# EAGLE design usbtiny-v2-SS (EAGLE 6.2)
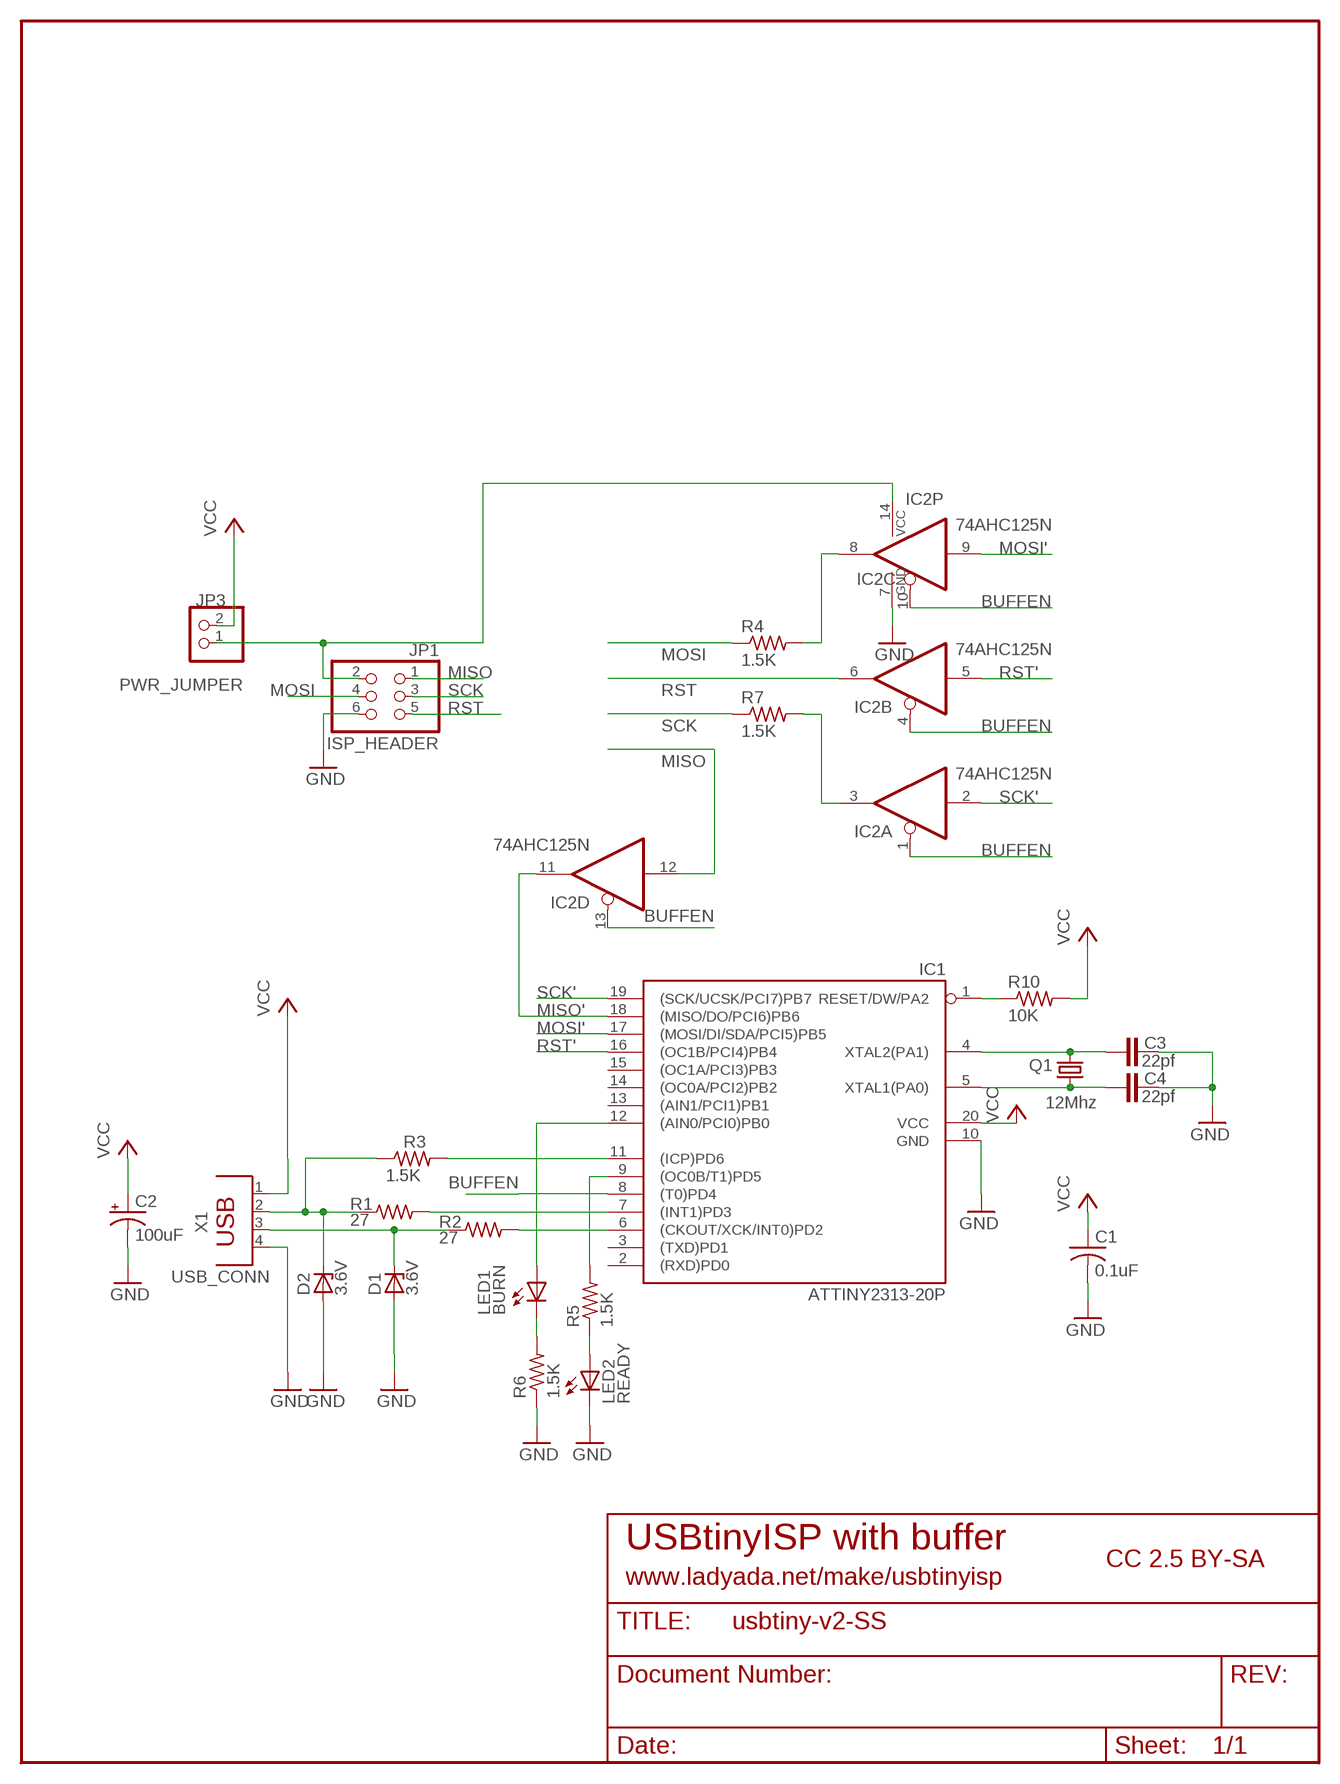
[diagram p0: schematic, sheet 1]

## Parts
C1  0.1uF  C-US025-025X050  [C025-025X050]
C2  100uF  CPOL-USE2.5-5  [E2,5-5]
C3  22pf  C-EU025-025X050  [C025-025X050]
C4  22pf  C-EU025-025X050  [C025-025X050]
D1  3.6V  ZENER-DIODEDO35Z10  [DO35Z10]
D2  3.6V  ZENER-DIODEDO35Z10  [DO35Z10]
IC1  ATTINY2313-20P  [DIL20]
IC2  74AHC125N  74HC125N  [DIL14]
JP1  ISP_HEADER  PINHD-2X3  [2X03]
JP3  PWR_JUMPER  PINHD-1X2  [1X02]
LED1  BURN  LED3MM  [LED3MM]
LED2  READY  LED3MM  [LED3MM]
Q1  12Mhz  CRYSTALHC49S  [HC49/S]
R1  27  R-US_0207/10  [0207/10]
R2  27  R-US_0207/10  [0207/10]
R3  1.5K  R-US_0207/10  [0207/10]
R4  1.5K  R-US_0207/10  [0207/10]
R5  1.5K  R-US_0207/2V  [0207/2V]
R6  1.5K  R-US_0207/2V  [0207/2V]
R7  1.5K  R-US_0207/10  [0207/10]
R10  10K  R-US_0207/10  [0207/10]
X1  USB_CONN  PN61729  [PN61729]

## Nets
BUFFEN: IC1.8((T0)PD4) IC2.1(A:OE) IC2.4(B:OE) IC2.10(C:OE) IC2.13(D:OE)
GND: C1.2 C2.- C3.2 C4.2 D1.A D2.A IC1.10(GND) IC2.7(P:GND) JP1.6 LED2.K(C) R6.1 X1.4
MISO: IC2.12(D:I) JP1.1
MISO': IC1.18((MISO/DO/PCI6)PB6) IC2.11(D:O)
MOSI: JP1.4 R4.1
MOSI': IC1.17((MOSI/DI/SDA/PCI5)PB5) IC2.9(C:I)
N$1: D2.C R1.1 R3.1 X1.2
N$2: D1.C R2.1 X1.3
N$3: IC1.7((INT1)PD3) R1.2
N$6: IC1.6((CKOUT/XCK/INT0)PD2) R2.2
N$7: IC1.12((AIN0/PCI0)PB0) LED1.A
N$8: LED1.K(C) R6.2
N$9: IC1.1(RESET/DW/PA2) R10.1
N$10: IC1.9((OC0B/T1)PD5) R5.2
N$11: LED2.A R5.1
N$12: IC2.3(A:O) R7.2
N$13: IC2.8(C:O) R4.2
N$16: IC1.11((ICP)PD6) R3.2
N$17: C3.1 IC1.4(XTAL2(PA1)) Q1.2
N$18: C4.1 IC1.5(XTAL1(PA0)) Q1.1
RST: IC2.6(B:O) JP1.5
RST': IC1.16((OC1B/PCI4)PB4) IC2.5(B:I)
SCK: JP1.3 R7.1
SCK': IC1.19((SCK/UCSK/PCI7)PB7) IC2.2(A:I)
VCC: C1.1 C2.+ IC1.20(VCC) JP3.2 R10.2 X1.1
VCC_REMOTE: IC2.14(P:VCC) JP1.2 JP3.1
Unconnected: IC1.2((RXD)PD0) IC1.3((TXD)PD1) IC1.13((AIN1/PCI1)PB1) IC1.14((OC0A/PCI2)PB2) IC1.15((OC1A/PCI3)PB3)

## Notes on the sheet
- USBtinyISP with buffer
- CC 2.5 BY-SA
- www.ladyada.net/make/usbtinyisp

## Library data of the parts
C1 = rcl-ez:C-US: CAPACITOR, American symbol
C2 = rcl-ez:CPOL-US: POLARIZED CAPACITOR, American symbol
C3 C4 = rcl:C-EU: CAPACITOR, European symbol
D1 D2 = diode:ZENER-DIODE: Z-Diode
IC1 = avr:ATTINY2313: MICROCONTROLLER 2 Kbytes FLASH 128 bytes SRAM 128 bytes EEPROM USART USI
IC2 = 74xx-eu:74*125: Quad bus BUFFER, 3-state
JP1 = pinhead-ez:PINHD-2X3: PIN HEADER
JP3 = pinhead:PINHD-1X2: PIN HEADER
LED1 LED2 = minimidi:LED: LED OSRAM: - CHIPLED LG R971, LG N971, LY N971, LG Q971, LY Q971, LO R971, LY R971 LH N974, LH R974 LS Q976, LO Q976, LY Q976 LO Q996 - Hyper CHIPLED LW Q18S LB Q993, LB Q99A, LB R99A - SideLED LS A670, LO A670, LY A670, LG A670, LP A670 LB A673, LV A673, LT A673, LW A673 LH A674 LY A675 LS A676, LA A676, LO A676, LY A676, LW A676 LS A679, LY A679, LG A679 - Hyper Micro SIDELED® LS Y876, LA Y876, LO Y876, LY Y876 LT Y87S - SmartLED LW L88C, LW L88S LB L89C, LB L89S, LG L890 LS L89K, LO L89K, LY L89K LS L896, LA L896, LO L896, LY L896 - TOPLED LS T670, LO T670, LY T670, LG T670, LP T670 LSG T670, LSP T670, LSY T670, LOP T670, LYG T670 LG T671, LOG T671, LSG T671 LB T673, LV T673, LT T673, LW T673 LH T674 LS T676, LA T676, LO T676, LY T676, LB T676, LH T676, LSB T676, LW T676 LB T67C, LV T67C, LT T67C, LS T67K, LO T67K, LY T67K, LW E67C LS E67B, LA E67B, LO E67B, LY E67B, LB E67C, LV E67C, LT E67C LW T67C LS T679, LY T679, LG T679 LS T770, LO T770, LY T770, LG T770, LP T770 LB T773, LV T773, LT T773, LW T773 LH T774 LS E675, LA E675, LY E675, LS T675 LS T776, LA T776, LO T776, LY T776, LB T776 LHGB T686 LT T68C, LB T68C - Hyper Mini TOPLED® LB M676 - Mini TOPLED Santana® LG M470 LS M47K, LO M47K, LY M47K Source: http://www.osram.convergy.de/
Q1 = crystal:CRYSTAL: CRYSTAL
R1-R7 R10 = rcl-ez:R-US_: RESISTOR, American symbol
X1 = con-berg-ez:PN61729: BERG USB connector

## Board
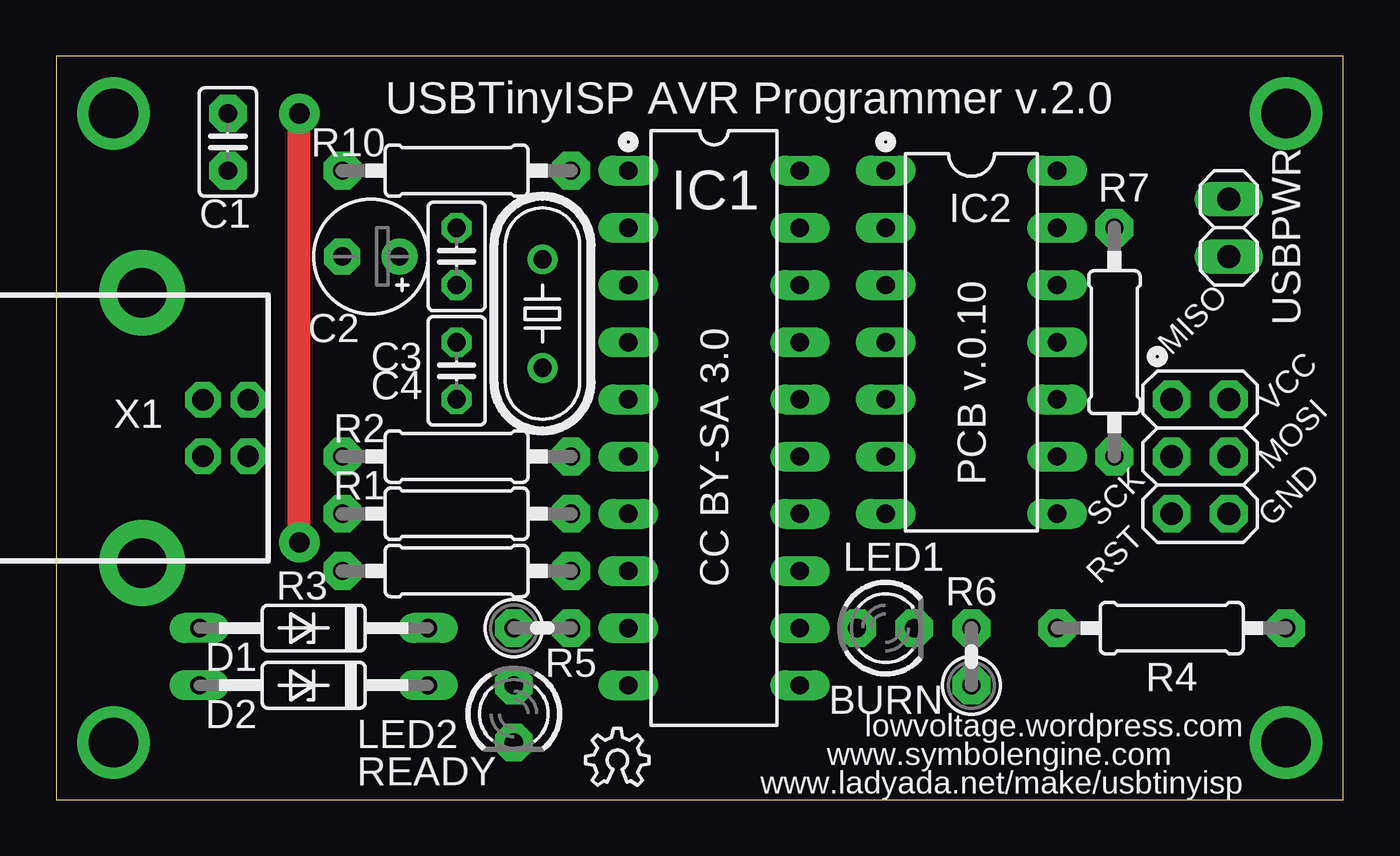
[diagram p1: board, top side]
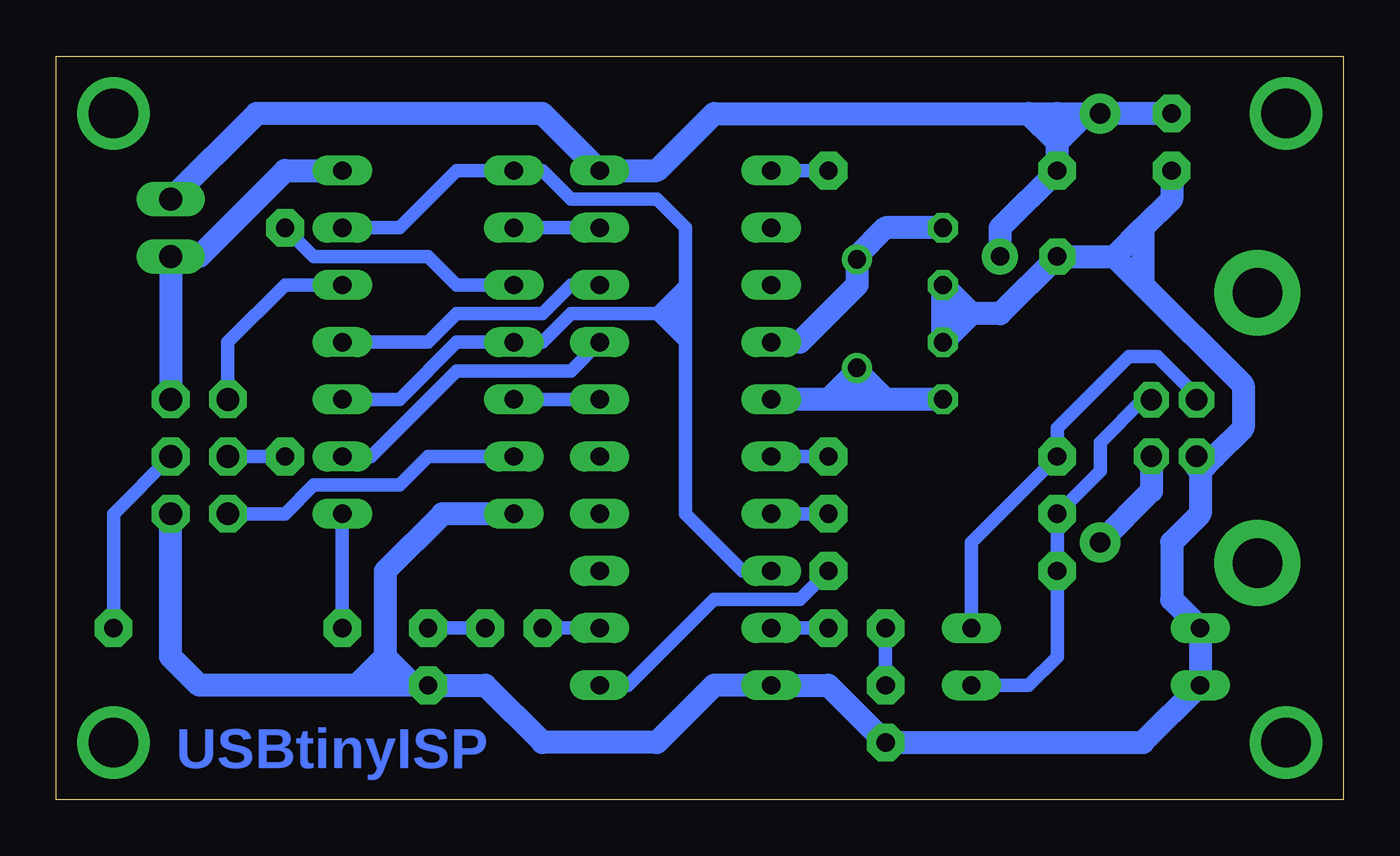
[diagram p2: board, bottom side, seen from below]

Size 57.15 x 33.02 mm. Coordinates in mm from the lower left corner, seen from the top.
Outline: 0,0 57.15,0 57.15,33.02 0,33.02 0,0
Copper layers (1*16): Top 0.035mm / dielectric 1.5mm / Bottom 0.035mm
Design rules: minimum track width 10mil, minimum drill 24mil, track to track 8mil, track to pad 8mil, pad to pad 8mil, via to via 8mil, smd to smd 8mil, copper to edge 40mil, drill to drill 8mil, minimum pad ring 10mil, minimum via ring 8mil, stop-mask expansion 4mil, vias tented up to drill 0mil, thermal gap 10mil

### Footprints (pad centres in the part's own frame; a part is rotated, then mirrored left to right if it is on the bottom)
C025-025X050 = drill 0.813 pad 1.676 octagon: 1 -1.27,0; 2 1.27,0
E2,5-5 = drill 0.813 pad 1.6: + -1.27,0 | drill 0.813 pad 1.6 octagon: - 1.27,0
C025-025X050' = drill 0.813 octagon: 1 -1.27,0; 2 1.27,0
DO35Z10 = drill 0.813 long: A 5.08,0; C -5.08,0
DIL20 = drill 0.813 long: 1 -11.43,-3.81; 2 -8.89,-3.81; 3 -6.35,-3.81; 4 -3.81,-3.81; 5 -1.27,-3.81; 6 1.27,-3.81; 7 3.81,-3.81; 8 6.35,-3.81; 9 8.89,-3.81; 10 11.43,-3.81; 11 11.43,3.81; 12 8.89,3.81; 13 6.35,3.81; 14 3.81,3.81; 15 1.27,3.81; 16 -1.27,3.81; 17 -3.81,3.81; 18 -6.35,3.81; 19 -8.89,3.81; 20 -11.43,3.81
DIL14 = drill 0.813 long: 1 -7.62,-3.81; 2 -5.08,-3.81; 3 -2.54,-3.81; 4 0,-3.81; 5 2.54,-3.81; 6 5.08,-3.81; 7 7.62,-3.81; 8 7.62,3.81; 9 5.08,3.81; 10 2.54,3.81; 11 0,3.81; 12 -2.54,3.81; 13 -5.08,3.81; 14 -7.62,3.81
2X03 = drill 1.016 pad 1.676 octagon: 1 -2.54,-1.27; 2 -2.54,1.27; 3 0,-1.27; 4 0,1.27; 5 2.54,-1.27; 6 2.54,1.27
1X02 = drill 1.016 long: 1 -1.27,0; 2 1.27,0
LED3MM = drill 0.813 pad 1.676 octagon: A -1.27,0; K 1.27,0
HC49/S = drill 0.813: 1 -2.413,0; 2 2.413,0
0207/10 = drill 0.813 pad 1.676 octagon: 1 -5.08,0; 2 5.08,0
0207/2V = drill 0.813 pad 1.676 octagon: 1 -1.27,0; 2 1.27,0
PN61729 = drill 0.95 pad 1.575 octagon: 1 1.25,4.71; 2 -1.25,4.71; 3 -1.25,2.71; 4 1.25,2.71 | drill 2.2 pad 3.81: P$1 -6,0; P$2 6,0

### Placement (x,y rotation side)
C1  7.62,29.21 270 top
C2  13.97,24.13 180 top
C3  22pf  [C025-025X050']  17.78,24.13 270 top
C4  22pf  [C025-025X050']  17.78,19.05 90 top
D1  11.43,7.62 180 top
D2  11.43,5.08 180 top
IC1  29.21,16.51 270 top
IC2  40.64,20.32 270 top
JP1  50.8,15.24 270 top
JP3  52.07,25.4 90 top
LED1  36.83,7.62 0 top
LED2  20.32,3.81 270 top
Q1  21.59,21.59 90 top
R1  17.78,12.7 0 top
R2  17.78,15.24 0 top
R3  17.78,10.16 0 top
R4  49.53,7.62 180 top
R5  21.59,7.62 0 top
R6  40.64,6.35 90 top
R7  46.99,20.32 90 top
R10  17.78,27.94 180 top
U$1  [OSHW_6X100_NOTEXT]  23.5,0.64 0 top
X1  3.81,16.51 270 top

### Tracks (layer width: path | path; a pad name or v marks a point on that pad's centre or on a via)
BUFFEN
  Bottom 0.61: 29.21,20.32 30.48,21.59 | 29.21,20.32 29.21,12.7 26.67,10.16 IC1.8 | IC2.13 41.91,25.4 39.37,27.94 IC2.1 35.56,27.94 34.29,26.67 30.48,26.67 29.21,25.4 29.21,22.86 | 29.21,22.86 29.21,22.23 | 29.21,22.23 29.21,21.59 | 29.21,21.59 29.21,20.95 | 29.21,20.95 29.21,20.32 | 30.48,21.59 29.21,22.86 | 30.48,21.59 29.84,21.59 | 29.84,21.59 29.21,21.59 | 29.21,22.23 29.84,21.59 | 29.21,20.95 29.84,21.59 | 30.48,21.59 34.29,21.59 35.56,20.32 IC2.4 39.37,20.32 41.91,17.78 IC2.10
GND
  Bottom 1.016: IC2.7 40.01,12.7 42.55,10.16 42.55,6.35 | JP1.6 52.07,6.35 50.8,5.08 44.45,5.08 43.81,5.08 | 42.55,5.08 43.18,5.08 43.81,5.08 | 16.51,21.59 15.24,21.59 C2.- 10.16,24.13 | 17.78,21.59 16.51,21.59 | 16.51,21.59 C4.2 C3.2 16.51,21.59 | 42.55,6.35 42.55,5.08 | 6.35,14.61 6.52,14.78 X1.4 6.5,15.24 5.71,15.24 | 6.35,14.61 6.35,12.7 7.62,11.43 7.62,8.89 D1.A D2.A 8.89,2.54 LED2.K 22.86,5.08 IC1.10 27.94,5.08 30.48,2.54 35.56,2.54 38.1,5.08 R6.1 41.27,5.08 | 10.16,24.13 8.89,22.86 | 8.89,22.86 4.45,18.41 4.45,16.51 5.71,15.24 | 5.71,15.24 6.35,14.61 | 41.27,5.08 42.55,5.08 | C1.2 7.62,26.67 8.89,25.4 | 8.89,25.4 10.16,24.13 | 8.89,25.4 8.89,22.86 | 43.81,5.08 42.55,6.35 | 42.55,6.35 41.27,5.08
MISO
  Bottom 0.61: IC2.12 46.99,22.86 49.53,20.32 JP1.1
MISO'
  Bottom 0.61: IC1.18 34.29,22.86 35.56,21.59 39.37,21.59 40.64,20.32 IC2.11
MOSI
  Bottom 0.61: JP1.4 54.61,12.7 R4.1
MOSI'
  Bottom 0.61: IC1.17 34.29,19.05 39.37,19.05 43.18,15.24 IC2.9
N$1
  Bottom 0.61: D2.C 13.97,5.08 12.7,6.35 R3.1 R1.1 10.79,14.61 10.79,15.88 8.89,17.78 8.54,17.78 X1.2
N$2
  Bottom 0.61: D1.C 16.51,11.43 R2.1 12.7,16.51 9.53,19.68 8.26,19.68 6.52,17.95 X1.3
N$3
  Bottom 0.61: R1.2 IC1.7
N$4  (via drill 2.2 pad 2.54)
  other vias: 2.54,30.48
N$6
  Bottom 0.61: IC1.6 R2.2
N$7
  Bottom 0.61: LED1.A IC1.12
N$8
  Bottom 0.61: LED1.K R6.2
N$9
  Bottom 0.61: R10.1 IC1.1
N$10
  Bottom 0.61: R5.2 IC1.9
N$11
  Bottom 0.61: LED2.A R5.1
N$12
  Bottom 0.61: IC2.3 39.37,22.86 40.64,24.13 45.72,24.13 R7.2
N$13
  Bottom 0.61: IC2.8 R4.2
N$15  (via drill 2.2 pad 2.54)
  other vias: 54.61,30.48
N$16
  Bottom 0.61: R3.2 24.13,8.89 27.94,8.89 31.75,5.08 IC1.11
N$17
  Bottom 1.016: C3.1 20.32,25.4 21.59,24.13 Q1.2 21.59,22.86 24.13,20.32 IC1.4
N$18
  Bottom 1.016: C4.1 20.32,17.78 | 20.32,17.78 21.59,17.78 | 21.59,17.78 22.86,17.78 | 21.59,17.78 21.59,19.05 | 21.59,19.05 Q1.1 | 20.32,17.78 21.59,19.05 | 21.59,19.05 22.86,17.78 | 22.86,17.78 IC1.5
N$19  (via drill 2.2 pad 2.54)
  other vias: 54.61,2.54
N$20  (via drill 2.2 pad 2.54)
  other vias: 2.54,2.54
RST
  Bottom 0.61: IC2.6 40.64,15.24 41.91,13.97 45.72,13.97 46.99,12.7 JP1.5
RST'
  Bottom 0.61: IC1.16 IC2.5
SCK
  Bottom 0.61: R7.1 JP1.3
SCK'
  Bottom 0.61: IC1.19 IC2.2
VCC  (via drill 0.9 pad 1.78)
  Top 1.016: v10.79,11.43 v10.79,30.48
  Bottom 1.016: 13.97,30.48 27.94,30.48 30.48,27.94 IC1.20 35.56,30.48 48.26,30.48 JP3.2 | 13.97,30.48 12.7,30.48 | 12.7,30.48 11.43,30.48 | 11.43,30.48 v10.79,30.48 C1.1 | 12.7,29.21 R10.2 15.24,25.4 C2.+ | 12.7,29.21 12.7,30.48 | 11.43,30.48 12.7,29.21 | 12.7,29.21 13.97,30.48 | X1.1 8.52,13.71 v10.79,11.43
VCC_REMOTE
  Bottom 1.016: IC2.14 46.99,27.94 50.8,24.13 JP3.1 JP1.2

### Text on the board
Bottom: USBtinyISP
tPlace: USBTinyISP AVR Programmer v.2.0 | USB | PWR | CC BY-SA 3.0 | MISO | VCC | MOSI | PCB v.0.10 | SCK | GND | RST | BURN | lowvoltage.wordpress.com | www.symbolengine.com | READY | www.ladyada.net/make/usbtinyisp